# Altium schematic sheet AC_Grid.SchDoc
size A4; SheetNumber: 3; SheetTotal: 5; SPICEModelCacheEYTXZMXP: <root> / <DocumentId>EYTXZMXP</DocumentId> / <CacheFrame Number="0"> / <Model Name="xl_744830017132_1.7m" Kind="CKT"> / <Text>*-------------------------------------------------------- / .subckt XL_744830017132_1.7m 1 2 3 4 / R1 N004 1 {Rdc} / R2 N006 N004 {dR4} / C1 N005 N004 {dC3} / L1 N011 N004 {dL3} / L2 N018 N019 {dL3} / C2 N011 N019 {ck} / R3 N006 N005 {dR3} / R4 N020 N022 {dR3} / C3 N022 N018 {dC3} / R5 N020 N018 {dR4} / L3 N006 N011 {dL3} / L4 N019 N020 {dL3} / R6 N018 2 {Rdc} / R8 N001 N006 {dR6} / C4 N007 N006 {dC4} / L5 N012 N006 {dL4} / L6 N020 N021 {dL4} / C5 N012 N021 {ck} / R9 N001 N007 {dR5} / R10 N013 N023 {dR5} / C6 N023 N020 {dC4} / R11 N013 N020 {dR6} / L7 N001 N012 {dL4} / L8 N021 N013 {dL4} / L9 N009 N008 {L3} / C7 N003 N002 {C1} / R13 N009 N008 {Rs3} / L10 4 N010 {L1} / R14 4 N010 {Rs1} / L11 N010 N009 {L2} / R15 N010 N009 {Rs2} / L12 N016 N015 {L3} / C8 N024 N014 {C1} / L13 3 N017 {L1} / L14 N017 N016 {L2} / R16 4 N003 {R2} / R17 3 N024 {R2} / L15 N015 N014 {L4} / R18 N008 N002 {Rs4} / L16 N008 N002 {L4} / R21 3 N017 {Rs1} / R22 N017 N016 {Rs2} / R23 N016 N015 {Rs3} / R24 N015 N014 {Rs4} / R25 N002 N001 {Rs5} / R26 N014 N013 {Rs5} / C9 N002 N001 {C2} / C10 N014 N013 {C2} / L17 N002 N001 {L5} / L18 N014 N013 {L5} / K7 L1 L3 L2 L4 0.9999 / K6 L5 L7 L6 L8 0.9999 / K3 L9 L12 1 / K2 L11 L14 1 / K1 L10 L13 1 / K4 L16 L15 1 / K5 L17  L18 1 / .param Rdc=0.01 / .param L1=1760.38e-006 / .param L2=700.35e-006 / .param L3=95.47e-006 / .param L4=99.22e-006 / .param L5=2.5e-010 / .param C1=1.98e-011 / .param C2=3e-016 / .param Rs1=12128 / .param Rs2=837 / .param Rs3=1493 / .param Rs4=1378 / .param Rs5=7490 / .param R2=17 / .param dL3=70e-08 / .param dC3=20e-012 / .param dL4=9.51e-09 / .param dC4=10e-09 / .param dR3=0.19 / .param dR4=4950 / .param dR5=1 / .param dR6=200 / .param ck=0.2pF / .backanno / .ends XL_744830017132_1.7m</Text> / </Model> / <Model Name="890303427009cs_1.5uf" Kind="CKT"> / <Text>******* / .subckt 890303427009CS_1.5uF 1 2 / Rser 1 3 0.0275799803666 / Lser 2 4 1.6818559318E-08 / C1 3 4 0.0000015 / Rpar 3 4 2000000000 / .ends 890303427009CS_1.5uF</Text> / </Model> / <Model Name="1812_8853522110011_470pf" Kind="CKT"> / <Text>******* / .subckt 1812_8853522110011_470pF 1 2 / Rser 1 3 0.235 / Lser 2 4 0.000000000505 / C1 3 4 0.00000000047 / Rpar 3 4 100000000000 / .ends 1812_8853522110011_470pF</Text> / </Model> / </CacheFrame> / </root>
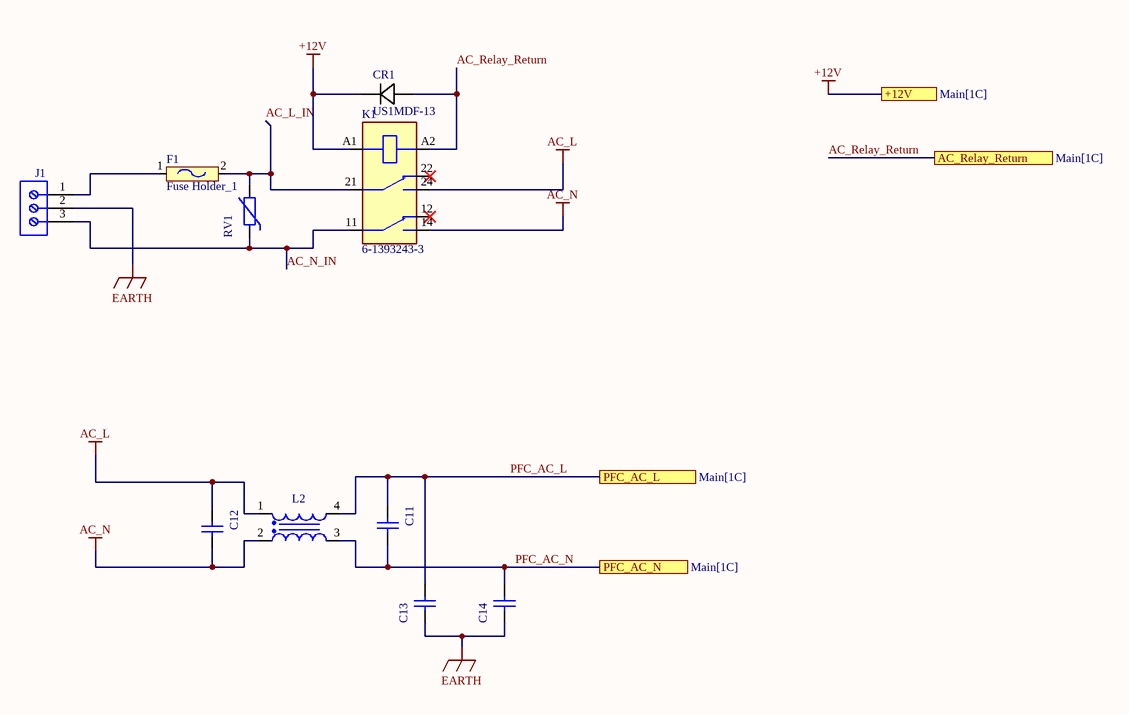
[diagram p0: AC_Grid.SchDoc]

## Parts
C11  1µF  [WCAP-FTBE_L26W9H18]  (value not drawn)
C12  1µF  [WCAP-FTBE_L26W9H18]  (value not drawn)
C13  470 pF  [WCAP-CSSA_1812_8853522110011]  (value not drawn)
C14  470 pF  [WCAP-CSSA_1812_8853522110011]  (value not drawn)
CR1  US1MDF-13  [DIODE_US1MDF-13_DIO-M]
F1  Fuse Holder_1  [Fuse Holder]
J1  691250610003  [691250610003]  (value not drawn)
K1  6-1393243-3  [RELAY_6-1393243-3]
L2  1.7mH  [WE-CMB HV_Type XL_744830017132]  (value not drawn)
RV1  275Vrms, 350Vdc  [D16.5W6.7H20P1.3]  (value not drawn)

## Ports
+12V (see Main[1C]), AC_Relay_Return (see Main[1C]), PFC_AC_L (see Main[1C]), PFC_AC_N (see Main[1C])

## Nets
+12V: CR1.1 K1.A1 ; port +12V
AC_L: C12.1 K1.24 L2.1
AC_N: C12.2 K1.14 L2.2
EARTH: C13.1 C14.1 J1.2
AC_L_IN: F1.2(VCC26) K1.21 RV1.2
AC_N_IN: J1.3 K1.11 RV1.1
AC_Relay_Return: CR1.2 K1.A2 ; port AC_Relay_Return
PFC_AC_L: C11.1 C13.2 L2.4 ; port PFC_AC_L
PFC_AC_N: C11.2 C14.2 L2.3 ; port PFC_AC_N
NetF1_1: F1.1(VCC27) J1.1

Not connected (* = marked no-connect by the designer): K1 12* 22*

## Library data of the parts
C11 C12 = 890283426008CS: WCAP-FTBE Film Capacitor, THT, L26 x W9 x H18mm, 1µF, 400V; Manufacturer: Wurth Elektronik; Dissipation Factor @1kHz: 1%; Insulation Resistance: 3GΩ; Rate of Voltage Rise: 13V/µs; Rated Voltage @85degC: 400V (DC); Rated Voltage @105degC: 320V (DC); Manufacturer Part Number: 890283426008CS; Category: Film Capacitors; Match Code: WCAP-FTBE; ComponentLink1Description: Website Link; ComponentLink1URL: https://www.we-online.com/redexpert/article/890283426008CS?ad; ComponentLink2Description: Datasheet Link; ComponentLink2URL: https://www.we-online.com/redexpert/spec/890283426008CS?ad; Mount: Through Hole; Min Operating Temperature: -40°C; Max Operating Temperature: 85°C; Packaging: Carton; Length: 26mm; Width: 9mm; Height: 18mm; Capacitance: 1µF
C13 C14 = 8853522110011: WCAP-CSSA Multilayer Ceramic Chip Safety Capacitor, SMT, size 1812, X7R Class II, 470 pF, 250 V (AC); Manufacturer: Wurth Elektronik; Case/Size Code: 1812; Capacitance Tolerance: ±10%; Dissipation Factor: 2.5%; Impulse Voltage: 5000 V (DC); Insulation Resistance: 10 GΩ; Safety Class: X1 / Y2; Manufacturer Part Number: 8853522110011; Category: Multilayer Ceramic Chip Capacitors; Match Code: WCAP-CSSA; ComponentLink1Description: Website Link; ComponentLink1URL: https://www.we-online.com/redexpert/article/8853522110011?ad; ComponentLink2Description: Datasheet Link; ComponentLink2URL: https://www.we-online.com/redexpert/spec/8853522110011?ad; Mount: Surface Mount; Min Operating Temperature: -55 °C; Max Operating Temperature: 125 °C; Packaging: Tape and Reel; Length: 4.5 mm; Width: 3.2 mm; Height: 1.6 mm; Capacitance: 470 pF; Ceramic Type: X7R Class II; Rated Voltage: 250 V (AC)
CR1 = US1MDF-13: No Description Available; Mfr_Name: Diodes Inc; Type: DEV; Copyright: Copyright (C) 2021 Ultra Librarian. All rights reserved.; Manufacturer_Part_Number: US1MDF-13; RefDes: RefDes
J1 = 691250610003: WR-TBL Series 2506 Horizontal Entry Modular, THT, pitch 6.35mm, 03p; Manufacturer: Wurth Elektronik; Modularity: Yes; Rated Current: 24A; System: Rising Cage Clamp; Working Voltage: 300V; Manufacturer Part Number: 691250610003; Category: Terminal Block; Match Code: WR-TBL; ComponentLink1Description: Website Link; ComponentLink1URL: https://www.we-online.com/redexpert/article/691250610003?ad; ComponentLink2Description: Datasheet Link; ComponentLink2URL: https://www.we-online.com/redexpert/spec/691250610003?ad; Mount: Through Hole; Min Operating Temperature: -30°C; Max Operating Temperature: 120°C; Packaging: Box; Application: Rising Cage Clamp; Number of Pins: 3; Number of Rows: 1; Orientation: Horizontal; Lead Pitch: 6.35mm
K1 = 6-1393243-3: General Purpose Relay DPDT (2 Form C) 12VDC Coil Through Hole; MF: TE Connectivity; SnapEDA_Link: https://www.snapeda.com/parts/6-1393243-3/TE+Connectivity+Potter+%2526+Brumfield+Relays/view-part/?ref=snap; Package: None; Value: *; MP: 6-1393243-3; Check_prices: https://www.snapeda.com/parts/6-1393243-3/TE+Connectivity+Potter+%2526+Brumfield+Relays/view-part/?ref=eda
L2 = 744830017132: WE-CMB HV Common Mode Power Line Choke, THT, Type XL, 1.7mH, 13.2A, 10mOhm; Manufacturer: Wurth Elektronik; Case/Size Code: Type XL; Insulation Test Voltage (AC): 3000V; Material: MnZn; Rated Voltage (AC): 760V; Manufacturer Part Number: 744830017132; Category: Common Mode Chokes; Match Code: WE-CMB HV; ComponentLink1Description: Website Link; ComponentLink1URL: https://www.we-online.com/redexpert/article/744830017132?ad; ComponentLink2Description: Datasheet Link; ComponentLink2URL: https://www.we-online.com/redexpert/spec/744830017132?ad; Mount: Through Hole; Min Operating Temperature: -40°C; Max Operating Temperature: 125°C; Packaging: Tray; Length: 40mm; Width: 23mm; Height: 39.5mm; DC Resistance Max: 10mOhm; Inductance: 1.7mH; Rated Current: 13.2A
RV1 = 820542711: WE-VD Disk Varistor, THT, D16.5mm x H20mm, 275Vrms, 350Vdc, 4500A, 132J; Manufacturer: Wurth Elektronik; Operating Voltage (AC): 275V; Operating Voltage (DC): 350V; Power Dissipation: 0.6W; (Reverse) Breakdown Voltage: 430V; VDE Approval: Yes; Manufacturer Part Number: 820542711; Category: Surge Protection; Match Code: WE-VD; ComponentLink1Description: Website Link; ComponentLink1URL: https://www.we-online.com/redexpert/article/820542711?ad; ComponentLink2Description: Datasheet Link; ComponentLink2URL: https://www.we-online.com/redexpert/spec/820542711?ad; Mount: Through Hole; Min Operating Temperature: -40°C; Max Operating Temperature: 105°C; Packaging: Tape and Reel; Width: 6.7mm; Height: 20mm; Diameter: 16.5mm; Energy Absorption: 132J; (Reverse) Peak Pulse Current: 4500A